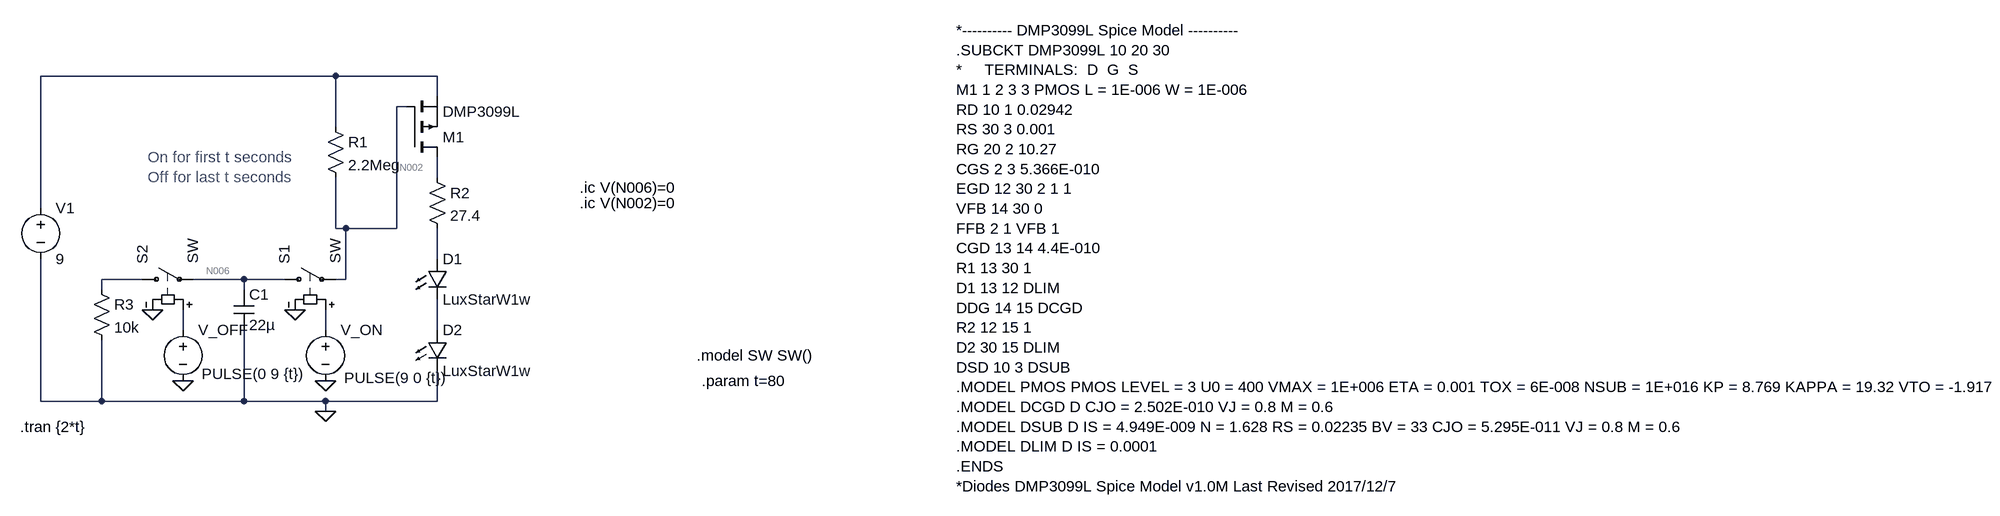
[diagram p0: schematic cab_lighting.asc]
cab_lighting.asc, the LTspice schematic file:
Version 4
SHEET 1 2884 680
WIRE 304 -256 -160 -256
WIRE 464 -256 304 -256
WIRE 464 -224 464 -256
WIRE 416 -208 400 -208
WIRE 304 -176 304 -256
WIRE 464 -96 464 -128
WIRE -160 -48 -160 -256
WIRE 304 -16 304 -96
WIRE 320 -16 304 -16
WIRE 400 -16 400 -208
WIRE 400 -16 320 -16
WIRE 464 32 464 -16
WIRE 0 64 -64 64
WIRE 160 64 80 64
WIRE 224 64 160 64
WIRE 320 64 320 -16
WIRE 320 64 304 64
WIRE -64 80 -64 64
WIRE 160 80 160 64
WIRE 64 144 64 112
WIRE 288 144 288 112
WIRE 464 144 464 96
WIRE -160 256 -160 32
WIRE -64 256 -64 160
WIRE -64 256 -160 256
WIRE 160 256 160 144
WIRE 160 256 -64 256
WIRE 288 256 160 256
WIRE 464 256 464 208
WIRE 464 256 288 256
WIRE 288 272 288 256
FLAG 288 272 0
FLAG 16 112 0
FLAG 240 112 0
FLAG 288 224 0
FLAG 64 224 0
SYMBOL voltage -160 -64 R0
SYMATTR InstName V1
SYMATTR Value 9
SYMBOL LED 448 32 R0
SYMATTR InstName D1
SYMATTR Value LuxStarW1w
SYMATTR Description Diode
SYMATTR Type diode
SYMBOL cap 144 80 R0
SYMATTR InstName C1
SYMATTR Value 22µ
SYMBOL res 288 -192 R0
SYMATTR InstName R1
SYMATTR Value 2.2Meg
SYMBOL res 448 -112 R0
SYMATTR InstName R2
SYMATTR Value 27.4
SYMBOL pmos 416 -128 M180
SYMATTR InstName M1
SYMATTR Value DMP3099L
SYMATTR Prefix X
SYMBOL res -80 64 R0
SYMATTR InstName R3
SYMATTR Value 10k
SYMBOL sw 208 64 R270
SYMATTR InstName S1
SYMBOL sw -16 64 R270
SYMATTR InstName S2
SYMBOL voltage 64 128 R0
WINDOW 3 29 85 Left 2
WINDOW 123 0 0 Left 0
WINDOW 39 0 0 Left 0
SYMATTR Value PULSE(0 9 {t})
SYMATTR InstName V_OFF
SYMBOL voltage 288 128 R0
WINDOW 3 29 91 Left 2
WINDOW 123 0 0 Left 0
WINDOW 39 0 0 Left 0
SYMATTR Value PULSE(9 0 {t})
SYMATTR InstName V_ON
SYMBOL LED 448 144 R0
SYMATTR InstName D2
SYMATTR Value LuxStarW1w
SYMATTR Description Diode
SYMATTR Type diode
TEXT 688 -80 Left 2 !.ic V(N006)=0
TEXT -192 296 Left 2 !.tran {2*t}
TEXT 872 184 Left 2 !.model SW SW()
TEXT 8 -128 Left 2 ;On for first t seconds\nOff for last t seconds
TEXT 688 -56 Left 2 !.ic V(N002)=0
TEXT 880 224 Left 2 !.param t=80
TEXT 1280 -328 Left 2 !*---------- DMP3099L Spice Model ----------\n.SUBCKT DMP3099L 10 20 30 \n*     TERMINALS:  D  G  S\nM1 1 2 3 3 PMOS L = 1E-006 W = 1E-006 \nRD 10 1 0.02942 \nRS 30 3 0.001 \nRG 20 2 10.27 \nCGS 2 3 5.366E-010 \nEGD 12 30 2 1 1 \nVFB 14 30 0 \nFFB 2 1 VFB 1 \nCGD 13 14 4.4E-010 \nR1 13 30 1 \nD1 13 12 DLIM \nDDG 14 15 DCGD \nR2 12 15 1 \nD2 30 15 DLIM \nDSD 10 3 DSUB \n.MODEL PMOS PMOS LEVEL = 3 U0 = 400 VMAX = 1E+006 ETA = 0.001 TOX = 6E-008 NSUB = 1E+016 KP = 8.769 KAPPA = 19.32 VTO = -1.917 \n.MODEL DCGD D CJO = 2.502E-010 VJ = 0.8 M = 0.6 \n.MODEL DSUB D IS = 4.949E-009 N = 1.628 RS = 0.02235 BV = 33 CJO = 5.295E-011 VJ = 0.8 M = 0.6  \n.MODEL DLIM D IS = 0.0001 \n.ENDS\n*Diodes DMP3099L Spice Model v1.0M Last Revised 2017/12/7

The netlist it stands for:
* cab_lighting.asc
V1 N001 0 9
D1 N004 N009 LuxStarW1w
C1 N006 0 22µ
R1 N001 N002 2.2Meg
R2 N003 N004 27.4
XM1 N003 N002 N001 DMP3099L  ; pins D G S
R3 N005 0 10k
S1 N006 N002 N008 0 SW
S2 N005 N006 N007 0 SW
V_OFF N007 0 PULSE(0 9 {t})
V_ON N008 0 PULSE(9 0 {t})
D2 N009 0 LuxStarW1w
.model D D
.lib standard.dio
.ic V(N006)=0
.tran {2*t}
.model SW SW()
* On for first t seconds
* Off for last t seconds
.ic V(N002)=0
.param t=80
*---------- DMP3099L Spice Model ----------
.SUBCKT DMP3099L 10 20 30
*     TERMINALS:  D  G  S
M1 1 2 3 3 PMOS L = 1E-006 W = 1E-006
RD 10 1 0.02942
RS 30 3 0.001
RG 20 2 10.27
CGS 2 3 5.366E-010
EGD 12 30 2 1 1
VFB 14 30 0
FFB 2 1 VFB 1
CGD 13 14 4.4E-010
R1 13 30 1
D1 13 12 DLIM
DDG 14 15 DCGD
R2 12 15 1
D2 30 15 DLIM
DSD 10 3 DSUB
.MODEL PMOS PMOS LEVEL = 3 U0 = 400 VMAX = 1E+006 ETA = 0.001 TOX = 6E-008 NSUB = 1E+016 KP = 8.769 KAPPA = 19.32 VTO = -1.917
.MODEL DCGD D CJO = 2.502E-010 VJ = 0.8 M = 0.6
.MODEL DSUB D IS = 4.949E-009 N = 1.628 RS = 0.02235 BV = 33 CJO = 5.295E-011 VJ = 0.8 M = 0.6
.MODEL DLIM D IS = 0.0001
.ENDS
*Diodes DMP3099L Spice Model v1.0M Last Revised 2017/12/7
.backanno
.end